# Altium schematic sheet PWR.SchDoc
size A; SheetNumber: 1; SheetTotal: 4
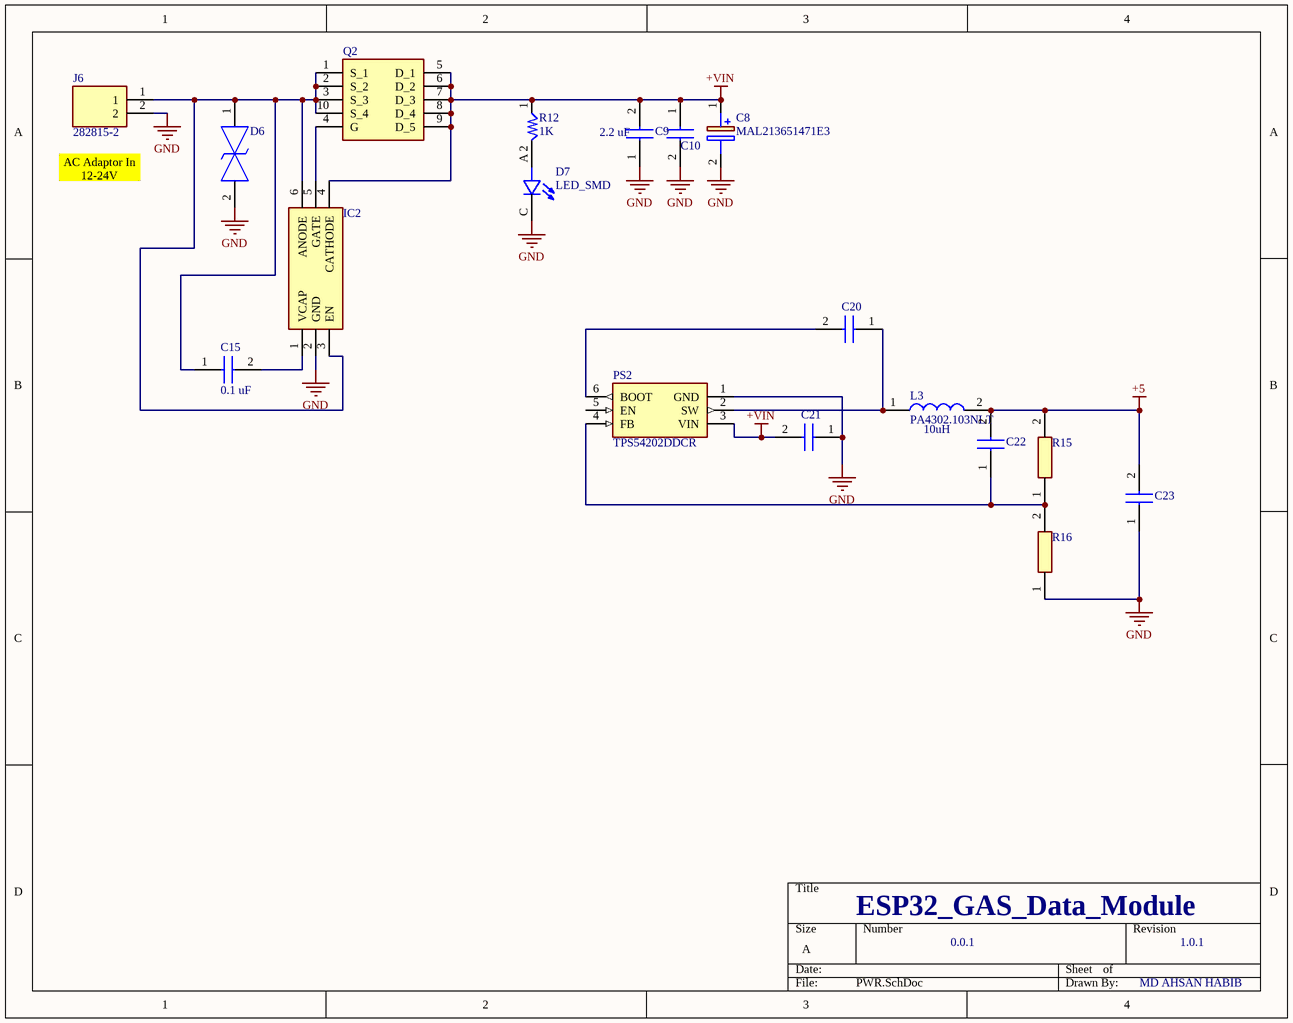
[diagram p0: PWR.SchDoc]

## Parts
C8  MAL213651471E3  [CAPPRD500W60D1300H2700]
C9  2.2 uF  [CAP0603]
C10  C5750X5R1H106K230KA  [C5750_Commercial]  (value not drawn)
C15  0.1 uF  [CAP0603]
C20  C0805C104M5RAC-TU  [CAPC2012X88N]  (value not drawn)
C21  C5750X5R1H106K230KA  [CAP0603]  (value not drawn)
C22  CGA1A2C0G1E820J030BA  [CAP0603]  (value not drawn)
C23  GRM32ER61C476KE15L  [CAPC3225X270N]  (value not drawn)
D6  SMBJ24CA-13-F  [DIONM5336X250N]  (value not drawn)
D7  LED_SMD  [LEDSC125X200X90-2N]
IC2  LM74700QDBVTQ1  [SOT95P280X145-6N]  (value not drawn)
J6  282815-2  [SHDRRA2W102P0X508_1X2_1016X1200X850P]
L3  PA4302.103NLT  [PA4302103NLT]
PS2  TPS54202DDCR  [SOT95P280X110-6N]
Q2  BSC014N06NSATMA1  [BSC010N04LS6ATMA1]  (value not drawn)
R12  1K  [RES0603]
R15  CRCW0402100KFKEDHP  [RES0603]  (value not drawn)
R16  CRCW040213K7FKEDHP  [RES0603]  (value not drawn)

## Nets
+5: C22.2 C23.2 L3.2 R15.2
+VIN: C8.1(+) C9.2 C10.1 C21.2 IC2.4(CATHODE) PS2.3(VIN) Q2.5(D_1) Q2.6(D_2) Q2.7(D_3) Q2.8(D_4) Q2.9(D_5) R12.1
GND: C8.2(-) C9.1 C10.2 C21.1 C23.1 D6.2 D7.C IC2.2(GND) J6.2 PS2.1(GND) R16.1
NetC15_1: C15.1 D6.1 IC2.3(EN) IC2.6(ANODE) J6.1 Q2.1(S_1) Q2.2(S_2) Q2.3(S_3) Q2.10(S_4)
NetC15_2: C15.2 IC2.1(VCAP)
NetC20_1: C20.1 L3.1 PS2.2(SW)
NetC20_2: C20.2 PS2.6(BOOT)
NetC22_1: C22.1 PS2.4(FB) R15.1 R16.2
NetD7_A: D7.A R12.2
NetIC2_5: IC2.5(GATE) Q2.4(G)

Not connected (* = marked no-connect by the designer): PS2 5(EN)

## Notes on the sheet
- (near J6) AC Adaptor In 12-24V
- (near L3) 10uH
- ESP32_GAS_Data_Module
- 0.0.1
- 1.0.1
- MD AHSAN HABIB

## Library data of the parts
C8 = MAL213651471E3: Capacitor Polarised; Manufacturer_Name: Vishay; Datasheet Link: https://www.mouser.co.uk/datasheet/2/427/136rvi-1762300.pdf; Height: 27mm; Manufacturer_Part_Number: MAL213651471E3; Mouser Part Number: 594-2222-136-51471; Mouser Price/Stock: https://www.mouser.co.uk/ProductDetail/Vishay-BC-Components/MAL213651471E3?qs=zGH8QOQ14qXx9%252BWDTpPwWA%3D%3D
C9 C15 = CC0603KRX7R9BB104: Capacitor; Manufacturer_Name: YAGEO; Datasheet Link: https://componentsearchengine.com/Datasheets/2/CC0603KRX7R9BB104.pdf; Height: 0.9mm; Manufacturer_Part_Number: CC0603KRX7R9BB104; Mouser Part Number: 603-CC603KRX7R9BB104; Mouser Price/Stock: https://www.mouser.co.uk/ProductDetail/YAGEO/CC0603KRX7R9BB104?qs=vTakOoo5QyLvVCYM2ge8LQ%3D%3D; Arrow Part Number: CC0603KRX7R9BB104; Arrow Price/Stock: https://www.arrow.com/en/products/cc0603krx7r9bb104/yageo?utm_currency=USD&region=europe
C10 C21 = C5750X5R1H106K230KA: Capacitor; Manufacturer_Name: TDK; Datasheet Link: https://product.tdk.com/system/files/dam/doc/product/capacitor/ceramic/mlcc/catalog/mlcc_commercial_general_en.pdf; Height: 2.5mm; Manufacturer_Part_Number: C5750X5R1H106K230KA; Mouser Part Number: 810-C5750X5R1H106K; Mouser Price/Stock: https://www.mouser.co.uk/ProductDetail/TDK/C5750X5R1H106K230KA?qs=NRhsANhppD8lVYAvl0MZ3g%3D%3D; Arrow Part Number: C5750X5R1H106K230KA; Arrow Price/Stock: https://www.arrow.com/en/products/c5750x5r1h106k230ka/tdk?region=nac
C20 = C0805C104M5RAC-TU: Capacitor; Manufacturer_Name: Yageo Group; Datasheet Link: https://connect.kemet.com:7667/gateway/IntelliData-ComponentDocumentation/1.0/download/specsheet/C0805C104M5RACTU; Height: 0.88mm; Manufacturer_Part_Number: C0805C104M5RAC-TU; Arrow Part Number: C0805C104M5RAC-TU; Arrow Price/Stock: https://www.arrow.com/en/products/c0805c104m5ractu/kemet-corporation?region=nac
C22 = CGA1A2C0G1E820J030BA: Capacitor; Manufacturer_Name: TDK; Datasheet Link: https://product.tdk.com/system/files/dam/doc/product/capacitor/ceramic/mlcc/catalog/mlcc_automotive_general_en.pdf; Height: 0.33mm; Manufacturer_Part_Number: CGA1A2C0G1E820J030BA
C23 = GRM32ER61C476KE15L: Capacitor; Manufacturer_Name: Murata Electronics; Datasheet Link: https://search.murata.co.jp/Ceramy/image/img/A01X/G101/ENG/GRM32ER61C476KE15-01A.pdf; Height: 2.7mm; Manufacturer_Part_Number: GRM32ER61C476KE15L; Mouser Part Number: 81-GRM32ER61C476KE5L; Mouser Price/Stock: https://www.mouser.co.uk/ProductDetail/Murata-Electronics/GRM32ER61C476KE15L?qs=%252B%2F7tQhzlcy7Im%2F1Gh2YSGQ%3D%3D; Arrow Part Number: GRM32ER61C476KE15L; Arrow Price/Stock: https://www.arrow.com/en/products/grm32er61c476ke15l/murata-manufacturing?utm_currency=USD&region=europe
D6 = SMBJ24CA-13-F: TVS Diode (Bi-directional); Manufacturer_Name: Diodes Incorporated; Datasheet Link: https://www.diodes.com/assets/Datasheets/ds19002.pdf; Height: 2.5mm; Manufacturer_Part_Number: SMBJ24CA-13-F; Mouser Part Number: 621-SMBJ24CA-13-F; Mouser Price/Stock: https://www.mouser.co.uk/ProductDetail/Diodes-Incorporated/SMBJ24CA-13-F?qs=gaDBXWSqsDCkhBi9r6ReOQ%3D%3D; Arrow Part Number: SMBJ24CA-13-F; Arrow Price/Stock: https://www.arrow.com/en/products/smbj24ca-13-f/diodes-incorporated?utm_currency=USD&region=nac
D7 = 5990110007F: Red 633nm LED Indication - Discrete 2.1V 0805 (2012 Metric); MF: Dialight; MP: 599-0110-007F; Check_prices: https://www.snapeda.com/parts/599-0110-007F/Dialight/view-part/?ref=eda; Value: *; Purchase-URL: https://pricing.snapeda.com/search/part/599-0110-007F/?ref=eda; Price: None; SnapEDA_Link: https://www.snapeda.com/parts/599-0110-007F/Dialight/view-part/?ref=snap; Availability: In Stock; Package: 0805 Dialight
IC2 = LM74700-Q1MKX-1_NOPB: Integrated Circuit; Manufacturer_Name: Texas Instruments; Manufacturer_Part_Number: LM74700-Q1MKX-1/NOPB; Datasheet Link: http://www.ti.com/lit/ds/symlink/lm74700-q1.pdf; Height: 1.45mm
J6 = 282815-2: Connector; Manufacturer_Name: TE Connectivity; Datasheet Link: https://www.te.com/commerce/DocumentDelivery/DDEController?Action=srchrtrv&DocNm=1-773958-1&DocType=Data%20Sheet&DocLang=English&PartCntxt=282815-2&DocFormat=pdf; Height: 8.5mm; Manufacturer_Part_Number: 282815-2; Mouser Part Number: 571-282815-2; Mouser Price/Stock: https://www.mouser.co.uk/ProductDetail/TE-Connectivity/282815-2?qs=79%2FjLZ2kXkpF7MFURi982A%3D%3D; Arrow Part Number: 282815-2; Arrow Price/Stock: https://www.arrow.com/en/products/282815-2/te-connectivity?region=nac
L3 = PA4302.103NLT: Inductor; Manufacturer_Name: Yageo Group; Datasheet Link: https://www.mouser.com/datasheet/2/336/-559356.pdf; Height: 5.6mm; Manufacturer_Part_Number: PA4302.103NLT; Mouser Part Number: 673-PA4302.103NLT; Mouser Price/Stock: https://www.mouser.co.uk/ProductDetail/Pulse-Electronics/PA4302.103NLT?qs=ZU1dyKYMvyPXoPwo6qMOJg%3D%3D; Arrow Part Number: PA4302.103NLT; Arrow Price/Stock: https://www.arrow.com/en/products/pa4302.103nlt/pulse-electronics-corporation?region=nac
PS2 = TPS54202DDCR: Power Supply; Manufacturer_Name: Texas Instruments; Datasheet Link: http://www.ti.com/lit/gpn/tps54202; Height: 1.1mm; Manufacturer_Part_Number: TPS54202DDCR; Mouser Part Number: 595-TPS54202DDCR; Mouser Price/Stock: https://www.mouser.co.uk/ProductDetail/Texas-Instruments/TPS54202DDCR?qs=uP22XH7NdCsJtN%2Fq54jCtQ%3D%3D; Arrow Part Number: TPS54202DDCR; Arrow Price/Stock: https://www.arrow.com/en/products/tps54202ddcr/texas-instruments?utm_currency=USD&region=nac
Q2 = BSC014N06NSATMA1: MOSFET (N-Channel); Manufacturer_Name: Infineon; Datasheet Link: http://www.farnell.com/datasheets/1849651.html; Height: 1.1mm; Manufacturer_Part_Number: BSC014N06NSATMA1; Mouser Part Number: 726-BSC014N06NSATMA1; Mouser Price/Stock: https://www.mouser.co.uk/ProductDetail/Infineon-Technologies/BSC014N06NSATMA1?qs=K00xGehIljshgUA78G26tg%3D%3D; Arrow Part Number: BSC014N06NSATMA1; Arrow Price/Stock: https://www.arrow.com/en/products/bsc014n06nsatma1/infineon-technologies-ag?region=nac
R12 = RES: Resistor; Manufacturer_Name: UNI-ROYAL(Uniroyal Elec); Manufacturer_Part_Number: 0603WAF1001T5E; Datasheet Link: https://datasheet.lcsc.com/szlcsc/Uniroyal-Elec-0603WAF1001T5E_C21190.pdf; Height: 0.55mm
R15 = CRCW0402100KFKEDHP: Resistor; Manufacturer_Name: Vishay; Datasheet Link: http://www.vishay.com/docs/20035/dcrcwe3.pdf; Height: 0.4mm; Manufacturer_Part_Number: CRCW0402100KFKEDHP; Mouser Part Number: 71-CRCW0402100KFKEDH; Mouser Price/Stock: https://www.mouser.co.uk/ProductDetail/Vishay-Dale/CRCW0402100KFKEDHP?qs=k2%2FDWSARqgGFakjlJe4Ejw%3D%3D; Arrow Part Number: CRCW0402100KFKEDHP; Arrow Price/Stock: https://www.arrow.com/en/products/crcw0402100kfkedhp/vishay?utm_currency=USD&region=nac
R16 = CRCW040213K7FKEDHP: Resistor; Manufacturer_Name: Vishay; Datasheet Link: http://www.vishay.com/docs/20035/dcrcwe3.pdf; Height: 0.4mm; Manufacturer_Part_Number: CRCW040213K7FKEDHP; Mouser Part Number: N/A; Mouser Price/Stock: https://www.mouser.co.uk/ProductDetail/Vishay-Dale/CRCW040213K7FKEDHP?qs=VAB4DzKv5wWcbGmoe9QIoA%3D%3D; Arrow Part Number: CRCW040213K7FKEDHP; Arrow Price/Stock: https://www.arrow.com/en/products/crcw040213k7fkedhp/vishay?region=nac